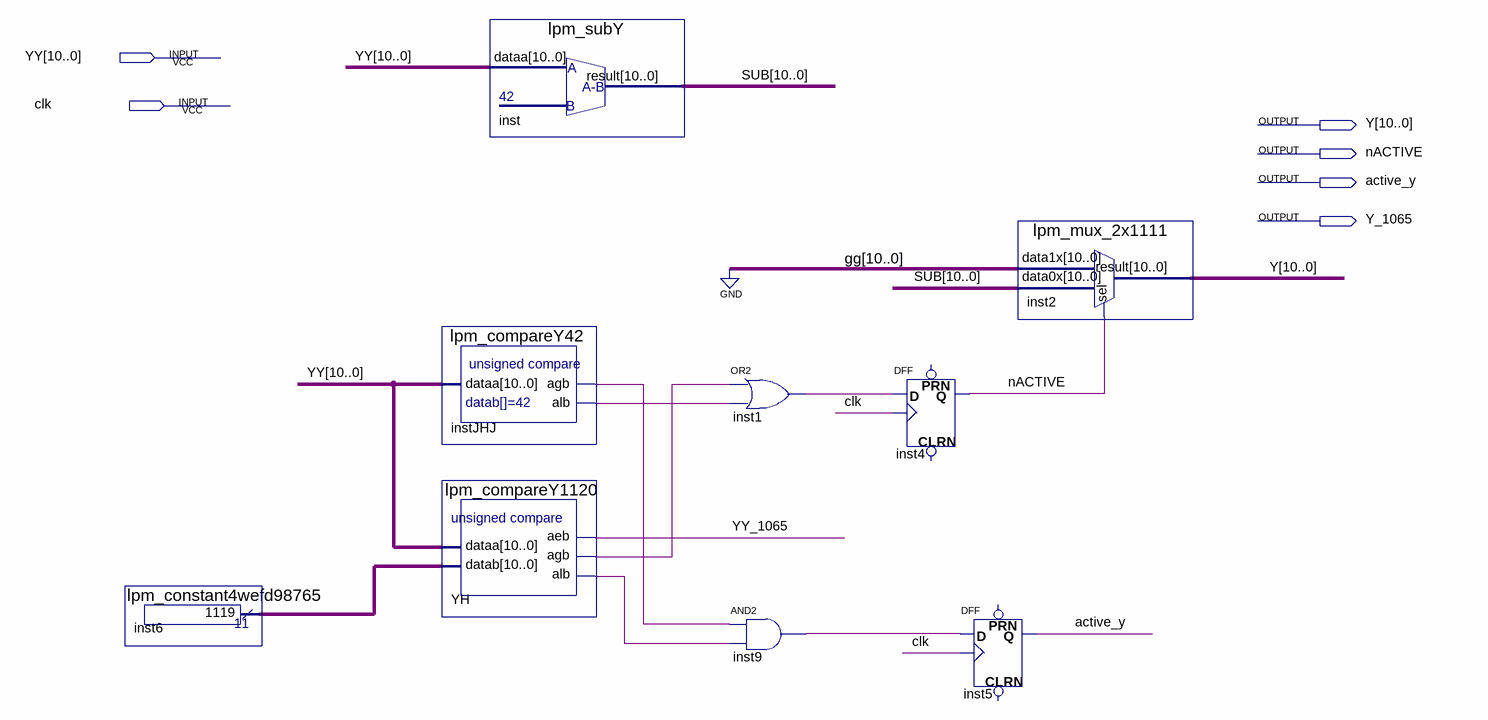
[diagram p0: schematic sheet]
// Quartus schematic Y_CORR.bdf as structural Verilog: 9 symbols, 6 pins
module Y_CORR (
  input  [10:0] YY,
  input  clk,
  output [10:0] Y,
  output nACTIVE,
  output active_y,
  output Y_1065
);

  wire inst1_out, inst9_out, instJHJ_agb, instJHJ_alb, YH_agb, YH_alb, YY_1065;
  wire [10:0] inst6_result, SUB;

  lpm_constant4wefd98765 inst6 (.result(inst6_result));
  lpm_subY inst (.dataa(YY), .result(SUB));
  lpm_compareY42 instJHJ (.dataa(YY), .agb(instJHJ_agb), .alb(instJHJ_alb));
  lpm_compareY1120 YH (.dataa(YY), .datab(inst6_result), .aeb(YY_1065), .agb(YH_agb), .alb(YH_alb));
  or inst1 (inst1_out, YH_agb, instJHJ_alb);
  and inst9 (inst9_out, instJHJ_agb, YH_alb);
  DFF inst4 (.CLK(clk), .D(inst1_out), .Q(nACTIVE));  // open: CLRN, PRN
  DFF inst5 (.CLK(clk), .D(inst9_out), .Q(active_y));  // open: CLRN, PRN
  lpm_mux_2x1111 inst2 (.data1x({11{1'b0}}), .data0x(SUB), .sel(nACTIVE), .result(Y));
endmodule
